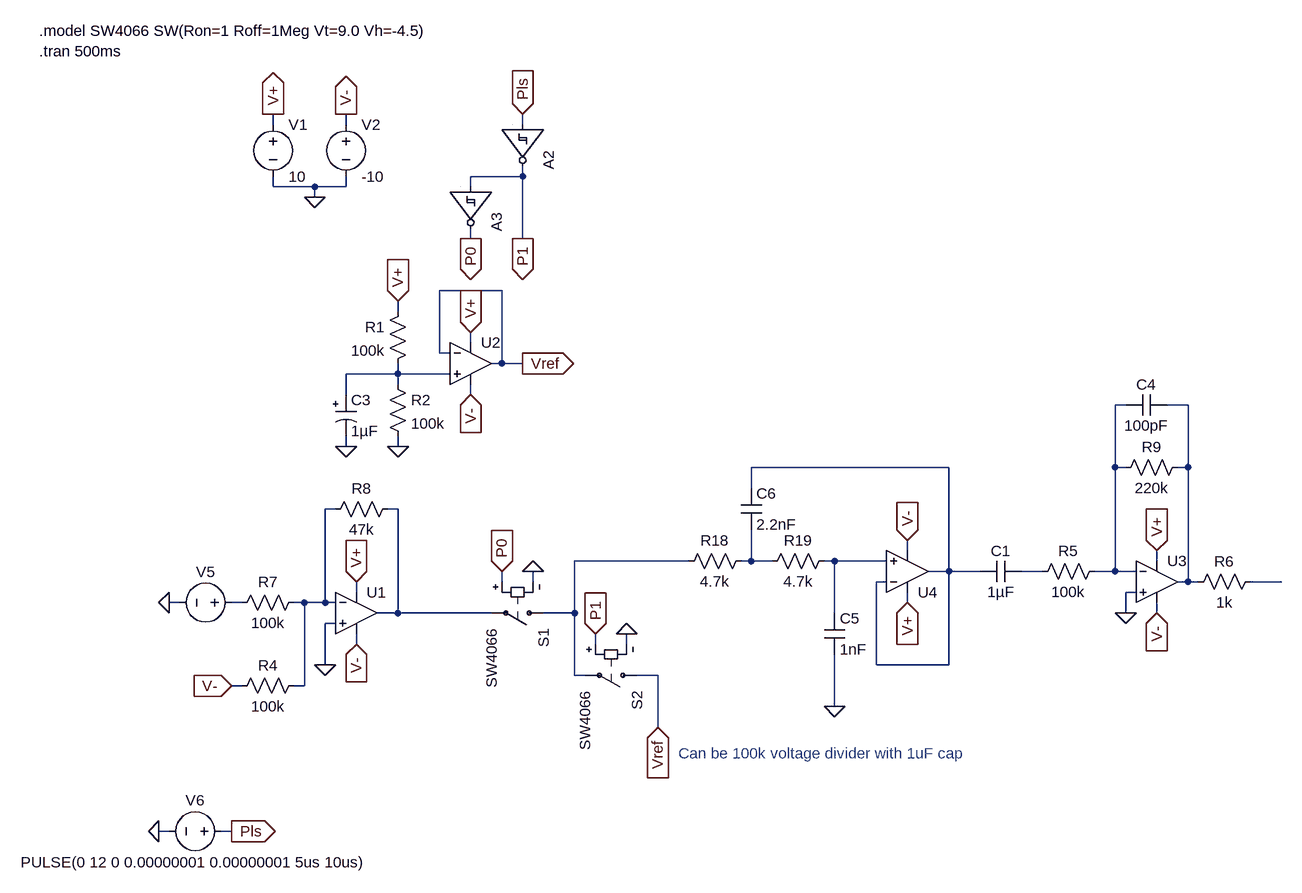
[diagram p0: schematic vca_audio_path_ac_coupled.asc]
vca_audio_path_ac_coupled.asc, the LTspice schematic file:
Version 4
SHEET 1 1136 1560
WIRE -704 176 -704 160
WIRE -592 176 -592 160
WIRE -320 176 -320 160
WIRE -320 256 -320 240
WIRE -320 256 -400 256
WIRE -704 272 -704 256
WIRE -640 272 -704 272
WIRE -592 272 -592 256
WIRE -592 272 -640 272
WIRE -400 272 -400 256
WIRE -640 288 -640 272
WIRE -400 352 -400 336
WIRE -320 352 -320 256
WIRE -352 432 -448 432
WIRE -512 464 -512 448
WIRE -400 512 -400 496
WIRE -448 528 -448 432
WIRE -432 528 -448 528
WIRE -352 544 -352 432
WIRE -352 544 -368 544
WIRE -320 544 -352 544
WIRE -512 560 -512 544
WIRE -512 560 -592 560
WIRE -432 560 -512 560
WIRE -512 576 -512 560
WIRE -592 592 -592 560
WIRE -400 592 -400 576
WIRE 608 608 592 608
WIRE 704 608 672 608
WIRE -592 672 -592 656
WIRE -512 672 -512 656
WIRE 336 704 32 704
WIRE 592 704 592 608
WIRE 608 704 592 704
WIRE 704 704 704 608
WIRE 704 704 688 704
WIRE 32 736 32 704
WIRE -608 768 -624 768
WIRE -512 768 -528 768
WIRE 272 832 272 816
WIRE -64 848 -240 848
WIRE 32 848 32 800
WIRE 32 848 16 848
WIRE 64 848 32 848
WIRE 160 848 144 848
WIRE 240 848 160 848
WIRE 656 848 656 832
WIRE 336 864 336 704
WIRE 336 864 304 864
WIRE 384 864 336 864
WIRE 480 864 448 864
WIRE 592 864 592 704
WIRE 592 864 560 864
WIRE 624 864 592 864
WIRE -352 880 -352 864
WIRE -304 880 -304 864
WIRE 240 880 224 880
WIRE 704 880 704 704
WIRE 704 880 688 880
WIRE 720 880 704 880
WIRE 848 880 800 880
WIRE -576 896 -576 880
WIRE 624 896 608 896
WIRE -848 912 -864 912
WIRE -752 912 -768 912
WIRE -656 912 -672 912
WIRE -624 912 -624 768
WIRE -624 912 -656 912
WIRE -608 912 -624 912
WIRE 272 912 272 896
WIRE -512 928 -512 768
WIRE -512 928 -544 928
WIRE -368 928 -512 928
WIRE -240 928 -240 848
WIRE -240 928 -288 928
WIRE 160 928 160 848
WIRE 608 928 608 896
WIRE 656 928 656 912
WIRE -608 944 -624 944
WIRE -576 976 -576 960
WIRE -208 976 -208 960
WIRE -160 976 -160 960
WIRE -624 1008 -624 944
WIRE 224 1008 224 880
WIRE 336 1008 336 864
WIRE 336 1008 224 1008
WIRE -240 1024 -240 928
WIRE -224 1024 -240 1024
WIRE -112 1024 -144 1024
WIRE -752 1040 -768 1040
WIRE -656 1040 -656 912
WIRE -656 1040 -672 1040
WIRE 160 1072 160 992
WIRE -112 1104 -112 1024
WIRE -864 1264 -880 1264
WIRE -768 1264 -784 1264
FLAG -592 160 V-
IOPIN -592 160 Out
FLAG -704 160 V+
IOPIN -704 160 Out
FLAG -640 288 0
FLAG -768 1264 Pls
IOPIN -768 1264 Out
FLAG -576 976 V-
IOPIN -576 976 In
FLAG -576 880 V+
IOPIN -576 880 In
FLAG -864 912 0
FLAG -304 864 0
FLAG -320 160 Pls
IOPIN -320 160 In
FLAG -160 960 0
FLAG 272 816 V-
IOPIN 272 816 In
FLAG 272 912 V+
IOPIN 272 912 In
FLAG -880 1264 0
FLAG -112 1104 Vref
IOPIN -112 1104 In
FLAG 656 928 V-
IOPIN 656 928 In
FLAG 656 832 V+
IOPIN 656 832 In
FLAG 608 928 0
FLAG -320 352 P1
IOPIN -320 352 Out
FLAG -400 352 P0
IOPIN -400 352 Out
FLAG -352 864 P0
IOPIN -352 864 In
FLAG -208 960 P1
IOPIN -208 960 In
FLAG 160 1072 0
FLAG -400 592 V-
IOPIN -400 592 In
FLAG -400 496 V+
IOPIN -400 496 In
FLAG -512 672 0
FLAG -512 448 V+
IOPIN -512 448 In
FLAG -592 672 0
FLAG -320 544 Vref
IOPIN -320 544 Out
FLAG -624 1008 0
FLAG -768 1040 V-
IOPIN -768 1040 In
SYMBOL voltage -704 160 R0
SYMATTR InstName V1
SYMATTR Value 10
SYMBOL voltage -592 160 R0
SYMATTR InstName V2
SYMATTR Value -10
SYMBOL res -656 896 R90
WINDOW 0 0 56 VBottom 2
WINDOW 3 32 56 VTop 2
SYMATTR InstName R7
SYMATTR Value 100k
SYMBOL voltage -752 912 R90
WINDOW 0 -32 56 VBottom 2
WINDOW 3 32 56 Invisible 2
SYMATTR InstName V5
SYMATTR Value PULSE(-10 5 0 10ms 0 0 10ms)
SYMBOL res -512 752 R90
WINDOW 0 0 56 VBottom 2
WINDOW 3 32 56 VTop 2
SYMATTR InstName R8
SYMATTR Value 47k
SYMBOL sw -272 928 R90
SYMATTR InstName S1
SYMATTR Value SW4066
SYMBOL Digital/schmtinv -256 176 R90
WINDOW 3 8 54 Left 2
SYMATTR InstName A2
SYMATTR SpiceLine VHigh=10 Vt=4.9 Vh=1.0 Trise=1ns Tfall=1ns
SYMBOL sw -128 1024 R90
SYMATTR InstName S2
SYMATTR Value SW4066
SYMBOL Digital/schmtinv -336 272 R90
WINDOW 3 8 54 Left 2
SYMATTR InstName A3
SYMATTR SpiceLine VHigh=10 Vt=4.9 Vh=1.0 Trise=1ns Tfall=1ns
SYMBOL res 32 832 R90
WINDOW 0 0 56 VBottom 2
WINDOW 3 32 56 VTop 2
SYMATTR InstName R18
SYMATTR Value 4.7k
SYMBOL cap 144 928 R0
SYMATTR InstName C5
SYMATTR Value 1nF
SYMBOL cap 16 736 R0
SYMATTR InstName C6
SYMATTR Value 2.2nF
SYMBOL res 160 832 R90
WINDOW 0 0 56 VBottom 2
WINDOW 3 32 56 VTop 2
SYMATTR InstName R19
SYMATTR Value 4.7k
SYMBOL voltage -768 1264 R90
WINDOW 0 -32 56 VBottom 2
WINDOW 3 32 56 VTop 2
WINDOW 39 0 0 Left 0
SYMATTR InstName V6
SYMATTR Value PULSE(0 12 0 0.00000001 0.00000001 5us 10us)
SYMBOL res 704 896 R270
WINDOW 0 32 56 VTop 2
WINDOW 3 0 56 VBottom 2
SYMATTR InstName R6
SYMATTR Value 1k
SYMBOL res 576 848 R90
WINDOW 0 0 56 VBottom 2
WINDOW 3 32 56 VTop 2
SYMATTR InstName R5
SYMATTR Value 100k
SYMBOL OpAmps/UniversalOpAmp 656 880 R0
SYMATTR InstName U3
SYMBOL OpAmps/UniversalOpAmp 272 864 M180
SYMATTR InstName U4
SYMBOL OpAmps/UniversalOpAmp -576 928 R0
SYMATTR InstName U1
SYMBOL cap 672 592 R90
WINDOW 0 0 32 VBottom 2
WINDOW 3 32 32 VTop 2
SYMATTR InstName C4
SYMATTR Value 100pF
SYMBOL res 704 688 R90
WINDOW 0 0 56 VBottom 2
WINDOW 3 32 56 VTop 2
SYMATTR InstName R9
SYMATTR Value 220k
SYMBOL cap 448 848 R90
WINDOW 0 0 32 VBottom 2
WINDOW 3 32 32 VTop 2
SYMATTR InstName C1
SYMATTR Value 1µF
SYMBOL OpAmps/UniversalOpAmp -400 544 R0
SYMATTR InstName U2
SYMBOL res -496 448 M0
SYMATTR InstName R1
SYMATTR Value 100k
SYMBOL res -528 560 R0
SYMATTR InstName R2
SYMATTR Value 100k
SYMBOL polcap -608 592 R0
SYMATTR InstName C3
SYMATTR Value 1µF
SYMBOL res -656 1024 R90
WINDOW 0 0 56 VBottom 2
WINDOW 3 32 56 VTop 2
SYMATTR InstName R4
SYMATTR Value 100k
TEXT -1064 32 Left 2 !.model SW4066 SW(Ron=1 Roff=1Meg Vt=9.0 Vh=-4.5)\n.tran 500ms
TEXT -80 1144 Left 2 ;Can be 100k voltage divider with 1uF cap

The netlist it stands for:
* vca_audio_path_ac_coupled.asc
V1 V+ 0 10
V2 V- 0 -10
R7 N005 N012 100k
V5 N012 0 PULSE(-10 5 0 10ms 0 0 10ms)
R8 N006 N005 47k
S1 N007 N006 P0 0 SW4066
A2 Pls 0 0 0 0 P1 0 0 SCHMITT VHigh=10 Vt=4.9 Vh=1.0 Trise=1ns Tfall=1ns
S2 Vref N007 P1 0 SW4066
A3 P1 0 0 0 0 P0 0 0 SCHMITT VHigh=10 Vt=4.9 Vh=1.0 Trise=1ns Tfall=1ns
R18 N008 N007 4.7k
C5 N009 0 1nF
C6 N004 N008 2.2nF
R19 N009 N008 4.7k
V6 Pls 0 PULSE(0 12 0 0.00000001 0.00000001 5us 10us)
R6 N003 N011 1k
R5 N002 N010 100k
XU3 0 N002 V+ V- N003 level1 Avol=1Meg GBW=10Meg Vos=0 En=0 Enk=0 In=0 Ink=0 Rin=500Meg  ; pins In+ In- V+ V- OUT
XU4 N009 N004 V+ V- N004 level1 Avol=1Meg GBW=10Meg Vos=0 En=0 Enk=0 In=0 Ink=0 Rin=500Meg  ; pins In+ In- V+ V- OUT
XU1 0 N005 V+ V- N006 level1 Avol=1Meg GBW=10Meg Vos=0 En=0 Enk=0 In=0 Ink=0 Rin=500Meg  ; pins In+ In- V+ V- OUT
C4 N003 N002 100pF
R9 N003 N002 220k
C1 N010 N004 1µF
XU2 N001 Vref V+ V- Vref level1 Avol=1Meg GBW=10Meg Vos=0 En=0 Enk=0 In=0 Ink=0 Rin=500Meg  ; pins In+ In- V+ V- OUT
R1 V+ N001 100k
R2 N001 0 100k
C3 N001 0 1µF
R4 N005 V- 100k
.model SW4066 SW(Ron=1 Roff=1Meg Vt=9.0 Vh=-4.5)
.tran 500ms
* Can be 100k voltage divider with 1uF cap
.lib UniversalOpAmp1.lib
.backanno
.end